# EAGLE design DISPLAY_IT3 (1) (EAGLE 9.6.2)
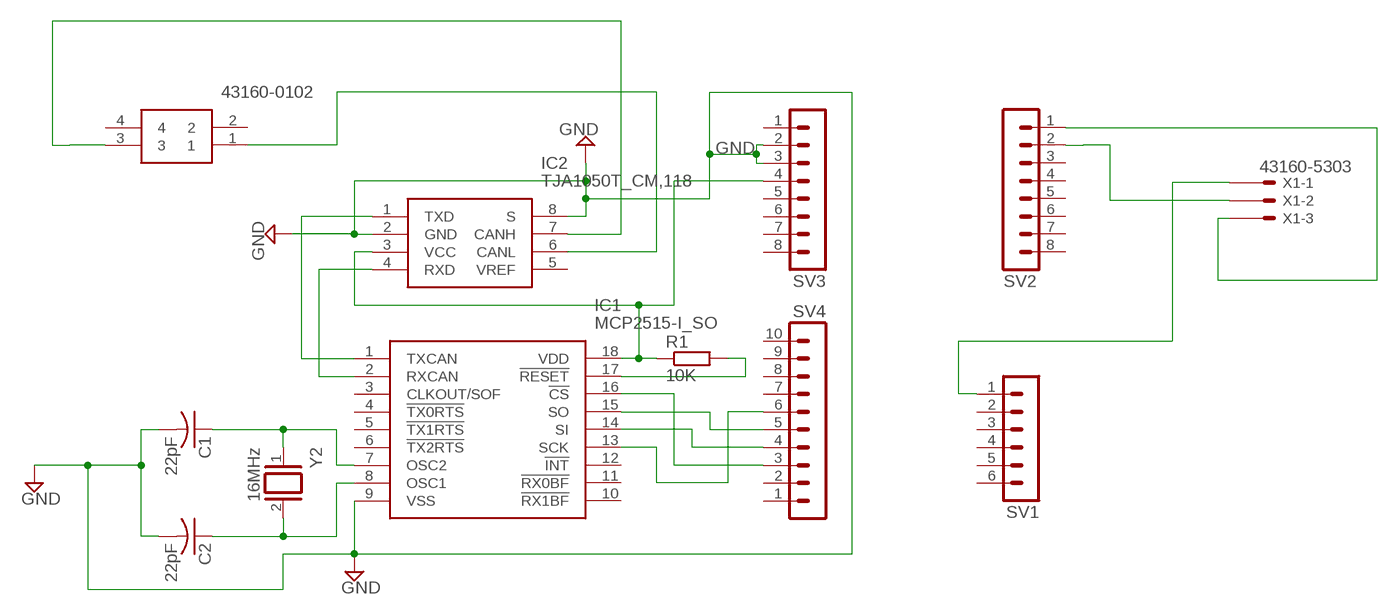
[diagram p0: schematic, sheet 1]

## Parts
C1  22pF  C-US025-024X044  [C025-024X044]
C2  22pF  C-US025-024X044  [C025-024X044]
DIFF_N  43160-0102  [431600102]
IC1  MCP2515-I_SO  [SOIC127P1030X265-18N]
IC2  TJA1050T_CM,118  [SOIC127P600X175-8N]
R1  10K  R-EU_0204/7  [0204/7]
SV1  MA06-1  [MA06-1]
SV2  MA08-1  [MA08-1]
SV3  MA08-1  [MA08-1]
SV4  MA10-1  [MA10-1]
X1  43160-5303  [43160-XX03]
Y2  16MHz  XTAL/S  [QS]

## Nets
DIFF1_N: C2.1 IC1.8(OSC1) Y2.2
DIFF1_P: C1.1 IC1.7(OSC2) Y2.1
DIFF_N [Diff_Pair]: DIFF_N.1 IC2.6(CANL)
DIFF_P [Diff_Pair]: DIFF_N.3 IC2.7(CANH)
GND: C1.2 C2.2 IC1.9(VSS) IC2.2(GND) IC2.8(S) SV3.2 SV3.3
N$1: IC1.15(SO) SV4.5
N$2: SV2.1 X1.3@1(-3:S)
N$3: IC1.1(TXCAN) IC2.1(TXD)
N$4: IC1.2(RXCAN) IC2.4(RXD)
N$5: IC1.16(!CS) SV4.3
N$6: IC1.14(SI) SV4.4
N$7: SV1.1 X1.1@1(-1:S)
N$8: IC1.13(SCK) SV4.6
N$9: IC1.17(!RESET) R1.2
N$11: SV2.2 X1.2@1(-2:S)
N$14: IC1.18(VDD) IC2.3(VCC) R1.1 SV3.4
Unconnected: DIFF_N.2 DIFF_N.4 IC1.3(CLKOUT/SOF) IC1.4(!TX0RTS) IC1.5(!TX1RTS) IC1.6(!TX2RTS) IC1.10(!RX1BF) IC1.11(!RX0BF) IC1.12(!INT) IC2.5(VREF) SV1.2 SV1.3 SV1.4 SV1.5 SV1.6 SV2.3 SV2.4 SV2.5 SV2.6 SV2.7 SV2.8 SV3.1 SV3.5 SV3.6 SV3.7 SV3.8 SV4.1 SV4.2 SV4.7 SV4.8 SV4.9 SV4.10 X1.1@2(-1:S) X1.2@2(-2:S) X1.3@2(-3:S)

## Library data of the parts
C1 C2 = rcl:C-US: CAPACITOR, American symbol; SPICEPREFIX: C
DIFF_N = 43160-0102:43160-0102: Molex SABRE 43160, 7.5mm Pitch, 2 Way, 1 Row PCB Header, Through Hole Source: Datasheet <https://componentsearchengine.com/Datasheets/1/43160-0102.pdf>; DESCRIPTION: Molex SABRE 43160, 7.5mm Pitch, 2 Way, 1 Row PCB Header, Through Hole; HEIGHT: 14.86mm; MANUFACTURER_NAME: Molex; MANUFACTURER_PART_NUMBER: 43160-0102; MOUSER_PART_NUMBER: 538-43160-0102; MOUSER_PRICE-STOCK: https://www.mouser.co.uk/ProductDetail/Molex/43160-0102?qs=P7cO%252B%252BFDLzSKycDBXp4ZKQ%3D%3D
IC1 = MCP2515-I_SO:MCP2515-I_SO: CAN Controller SPI data filtering SO18 Source: Datasheet <https://datasheet.datasheetarchive.com/originals/distributors/Datasheets-34/DSA-675138.pdf>; ARROW_PART_NUMBER: MCP2515-I/SO; ARROW_PRICE-STOCK: https://www.arrow.com/en/products/mcp2515-iso/microchip-technology?region=nac; DESCRIPTION: CAN Controller SPI data filtering SO18; HEIGHT: 2.65mm; MANUFACTURER_NAME: Microchip; MANUFACTURER_PART_NUMBER: MCP2515-I/SO; MOUSER_PART_NUMBER: 579-MCP2515-I/SO; MOUSER_PRICE-STOCK: https://www.mouser.co.uk/ProductDetail/Microchip-Technology-Atmel/MCP2515-I-SO?qs=KwArPi4cUogGDbGnphOvtQ%3D%3D
IC2 = TJA1050T_CM_118:TJA1050T_CM,118: NXP - TJA1050T/CM,118 - CAN TRANSCEIVER, 1TX/RX, SOIC-8 Source: Datasheet <http://www.nxp.com/docs/en/data-sheet/TJA1050.pdf>; ARROW_PART_NUMBER: TJA1050T/CM,118; ARROW_PRICE-STOCK: https://www.arrow.com/en/products/tja1050tcm118/nxp-semiconductors?region=nac; DESCRIPTION: NXP - TJA1050T/CM,118 - CAN TRANSCEIVER, 1TX/RX, SOIC-8; HEIGHT: 1.75mm; MANUFACTURER_NAME: NXP; MANUFACTURER_PART_NUMBER: TJA1050T/CM,118; MOUSER_PART_NUMBER: 771-TJA1050T/CM118; MOUSER_PRICE-STOCK: https://www.mouser.co.uk/ProductDetail/NXP-Semiconductors/TJA1050T-CM118?qs=5XOdhvmYM0NFFspw0VP5sA%3D%3D
R1 = rcl:R-EU_: RESISTOR, European symbol; SPICEPREFIX: R
SV1 = con-lstb:MA06-1: PIN HEADER; OC_FARNELL: unknown; OC_NEWARK: unknown
SV2 SV3 = con-lstb:MA08-1: PIN HEADER; OC_FARNELL: unknown; OC_NEWARK: unknown
SV4 = con-lstb:MA10-1: PIN HEADER; OC_FARNELL: unknown; OC_NEWARK: unknown
X1 = con-molex:43160-*03: SDA-43160 Connector Source: http://www.molex.com/pdm_docs/sd/431601306_sd.pdf; MF: MOLEX; MPN: 43160-5303; OC_FARNELL: unknown; OC_NEWARK: 92M1499
Y2 = SmartPrj:XTAL/S: CRYSTAL

## Net classes
1 Diff_Pair: width 0.406 mm

## Board
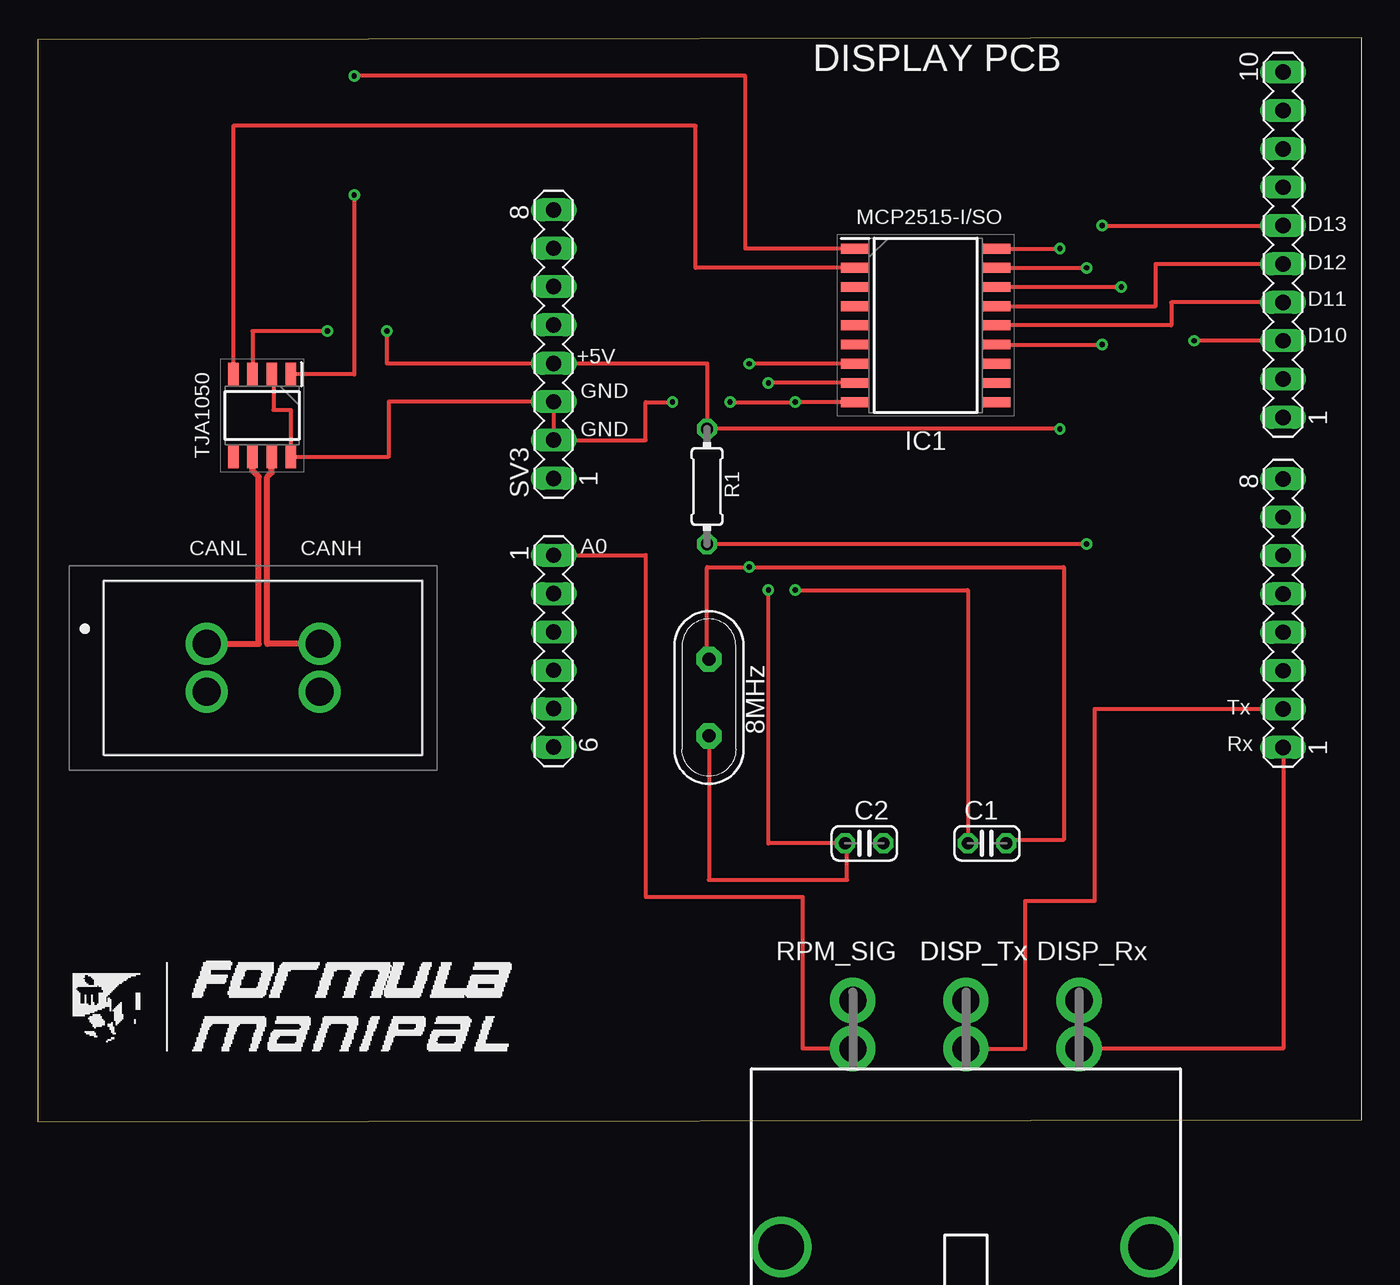
[diagram p1: board, top side]
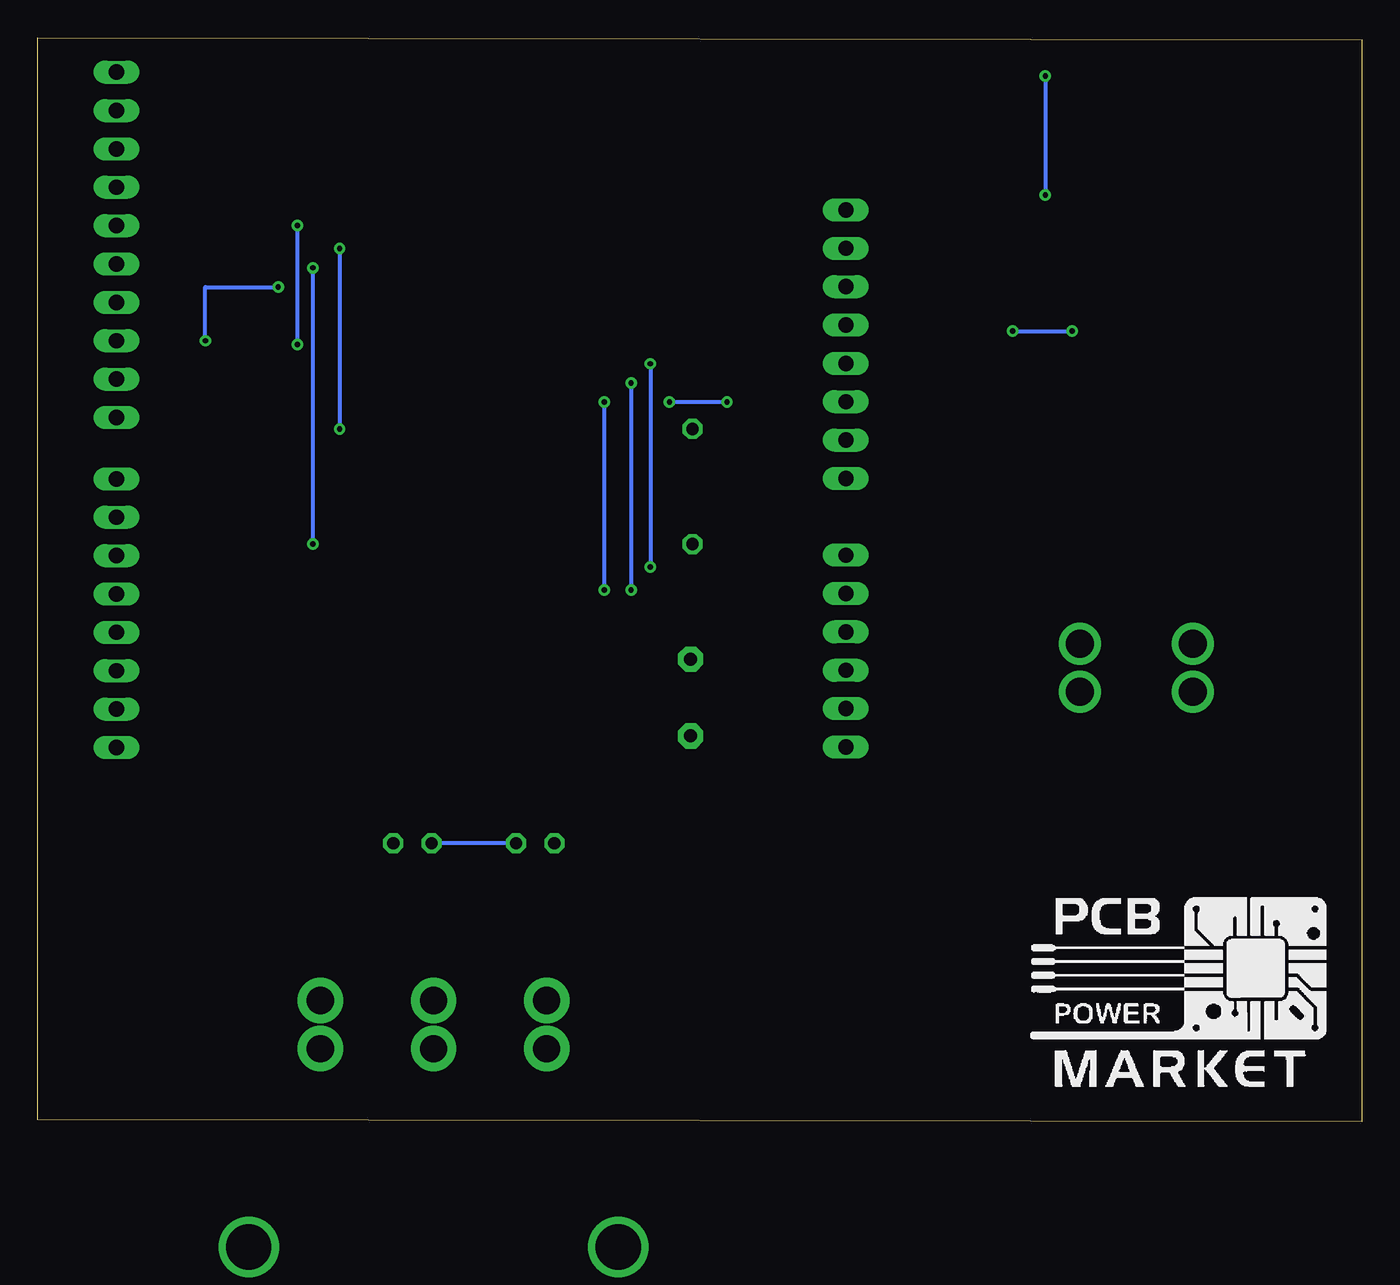
[diagram p2: board, bottom side, seen from below]

Size 87.68 x 71.75 mm. Coordinates in mm from the lower left corner, seen from the top.
Outline: 0,0 87.68,0.13 87.68,71.75 0,71.62 0,0
Copper layers (1*16): Top 0.035mm / dielectric 1.5mm / Bottom 0.035mm
Design rules "default": minimum track width 6mil, minimum drill 0.35mm, track to track 6mil, track to pad 6mil, pad to pad 6mil, via to via 6mil, smd to smd 6mil, copper to edge 40mil, drill to drill 6mil, minimum pad ring 10mil, minimum via ring 8mil, stop-mask expansion 4mil, vias tented up to drill 0mil, thermal gap 10mil

### Footprints (pad centres in the part's own frame; a part is rotated, then mirrored left to right if it is on the bottom)
C025-024X044 = drill 0.813 octagon: 1 -1.27,0; 2 1.27,0
431600102 = drill 1.86 pad 2.79: 1 0,0; 2 0,3.18; 3 -7.49,0; 4 -7.49,3.18
SOIC127P1030X265-18N = smd 1.85 x 0.65: 1 -4.675,5.08; 2 -4.675,3.81; 3 -4.675,2.54; 4 -4.675,1.27; 5 -4.675,0; 6 -4.675,-1.27; 7 -4.675,-2.54; 8 -4.675,-3.81; 9 -4.675,-5.08; 10 4.675,-5.08; 11 4.675,-3.81; 12 4.675,-2.54; 13 4.675,-1.27; 14 4.675,0; 15 4.675,1.27; 16 4.675,2.54; 17 4.675,3.81; 18 4.675,5.08
SOIC127P600X175-8N = smd 1.55 x 0.7: 1 -2.725,1.905; 2 -2.725,0.635; 3 -2.725,-0.635; 4 -2.725,-1.905; 5 2.725,-1.905; 6 2.725,-0.635; 7 2.725,0.635; 8 2.725,1.905
0204/7 = drill 0.813 octagon: 1 -3.81,0; 2 3.81,0
MA06-1 = drill 1.016 long: 1 -6.35,0; 2 -3.81,0; 3 -1.27,0; 4 1.27,0; 5 3.81,0; 6 6.35,0
MA08-1 = drill 1.016 long: 1 -8.89,0; 2 -6.35,0; 3 -3.81,0; 4 -1.27,0; 5 1.27,0; 6 3.81,0; 7 6.35,0; 8 8.89,0
MA10-1 = drill 1.016 long: 1 -11.43,0; 2 -8.89,0; 3 -6.35,0; 4 -3.81,0; 5 -1.27,0; 6 1.27,0; 7 3.81,0; 8 6.35,0; 9 8.89,0; 10 11.43,0
43160-XX03 = drill 1.8 pad 3: 1@1 -7.49,0; 1@2 -7.49,3.18; 2@1 0,0; 2@2 0,3.18; 3@1 7.49,0; 3@2 7.49,3.18 | drill 3 pad 3.4: M1 -12.24,-13.13; M2 12.24,-13.13
QS = drill 0.85 pad 1.676 octagon: 1 -2.54,0; 2 2.54,0

### Placement (x,y rotation side)
C1  62.87,18.41 180 top
C2  54.74,18.41 0 top
DIFF_N  11.18,31.62 180 top
IC1  58.8,52.7 0 top
IC2  14.86,46.74 270 top
R1  44.32,42.04 270 top
SV1  34.16,31.14 270 top
SV2  82.47,33.66 90 top
SV3  34.16,51.46 90 top
SV4  82.47,58.04 90 top
X1  61.47,4.83 0 top
Y2  44.45,28.07 270 top

### Tracks (layer width: path | path; a pad name or v marks a point on that pad's centre or on a via)
DIFF1_N  (via drill 0.35)
  Top 0.254: IC1.8 v48.39,48.89 | v48.39,35.18 48.39,18.41 C2.1 53.59,18.41 53.59,16 44.45,16 Y2.2
  Bottom 0.254: v48.39,48.89 v48.39,35.18
DIFF1_P  (via drill 0.35)
  Top 0.254: IC1.7 v47.12,50.16 | 64.13,18.67 67.94,18.67 67.94,36.7 v47.12,36.7 44.32,36.7 44.32,30.61 Y2.1
  Top 0.406: C1.1 64.13,18.67
  Bottom 0.254: v47.12,50.16 v47.12,36.7
DIFF_N
  Top 0.406: DIFF_N.1 14.64,31.62 14.64,42.67 14.22,43.09 IC2.6
DIFF_P
  Top 0.406: DIFF_N.3 15.2,31.62 15.2,42.67 15.49,42.97 IC2.7
GND  (via drill 0.35)
  Top 0.254: IC2.2 15.62,49.46 15.62,47.12 16.76,47.12 IC2.8 23.24,44.01 23.24,47.65 SV3.3 SV3.2 40.26,45.11 40.26,47.62 v42.04,47.62 | IC1.9 v50.16,47.62 v45.85,47.62 | v50.16,35.18 61.6,35.18 C1.2
  Bottom 0.254: C2.2 C1.2 | v50.16,47.62 v50.16,35.18 | v42.04,47.62 v45.85,47.62
N$1
  Top 0.254: SV4.5 74.04,56.77 74.04,53.97 IC1.15
N$2
  Top 0.254: SV2.1 82.47,4.83 X1.3@1
N$3  (via drill 0.35)
  Top 0.254: IC1.1 46.86,57.78 46.86,69.22 v20.95,69.22 | v20.95,61.34 20.95,49.46 IC2.1
  Bottom 0.254: v20.95,69.22 v20.95,61.34
N$4
  Top 0.254: IC1.2 43.56,56.52 43.56,65.91 12.95,65.91 IC2.4
N$5  (via drill 0.35)
  Top 0.254: SV4.3 v76.58,51.69 | v71.75,55.25 IC1.16
  Bottom 0.254: v76.58,51.69 76.58,55.25 v71.75,55.25
N$6
  Top 0.254: SV4.4 75.06,54.23 75.06,52.7 IC1.14
N$7
  Top 0.254: SV1.1 40.26,37.49 40.26,14.86 50.67,14.86 50.67,4.83 X1.1@1
N$8  (via drill 0.35)
  Top 0.254: IC1.13 v70.48,51.43 | v70.48,59.31 SV4.6
  Bottom 0.254: v70.48,51.43 v70.48,59.31
N$9  (via drill 0.35)
  Top 0.254: IC1.17 v69.47,56.52 | v69.47,38.23 R1.2
  Bottom 0.254: v69.47,56.52 v69.47,38.23
N$11
  Top 0.254: SV2.2 69.98,27.3 69.98,14.6 65.41,14.6 65.41,4.83 X1.2@1
N$14  (via drill 0.35)
  Top 0.254: IC1.18 v67.69,57.78 | v67.69,45.85 R1.1 44.32,50.19 SV3.4 23.11,50.19 v23.11,52.32 | v19.18,52.32 14.22,52.32 IC2.3
  Bottom 0.254: v67.69,57.78 v67.69,45.85 | v23.11,52.32 v19.18,52.32

### Text on the board
tPlace: DISPLAY PCB | MCP2515-I/SO | D13 | D12 | D11 | D10 | +5V | GND | GND | TJA1050 | CANL | CANH | A0 | Tx | 8MHz | Rx | RPM_SIG | DISP_Tx | DISP_Tx | DISP_Rx